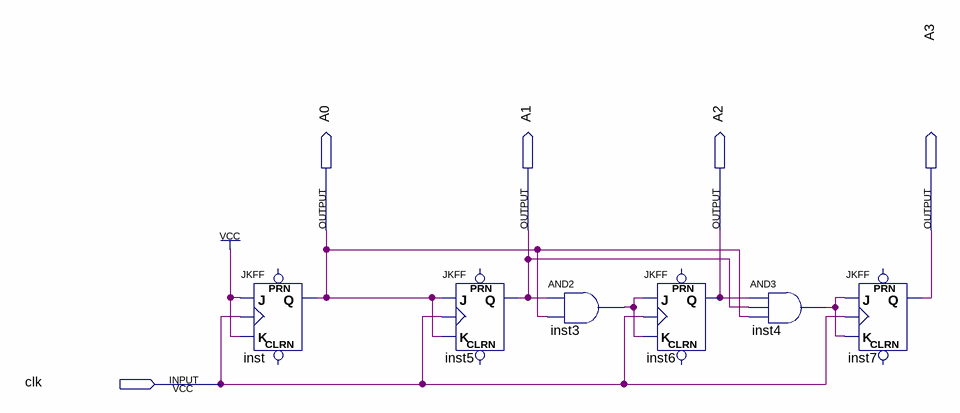
[diagram p0: schematic sheet]
// Quartus schematic Counter_2bit.bdf as structural Verilog: 6 symbols, 5 pins
module Counter_2bit (
  input  clk,
  output A0,
  output A1,
  output A2,
  output A3
);

  wire inst3_out, inst4_out;

  JKFF inst (.K(1'b1), .J(1'b1), .CLK(clk), .Q(A0));  // open: PRN, CLRN
  JKFF inst5 (.K(A0), .J(A0), .CLK(clk), .Q(A1));  // open: PRN, CLRN
  and inst3 (inst3_out, A1, A0);
  JKFF inst6 (.K(inst3_out), .J(inst3_out), .CLK(clk), .Q(A2));  // open: PRN, CLRN
  and inst4 (inst4_out, A2, A1, A0);
  JKFF inst7 (.K(inst4_out), .J(inst4_out), .CLK(clk), .Q(A3));  // open: PRN, CLRN
endmodule
